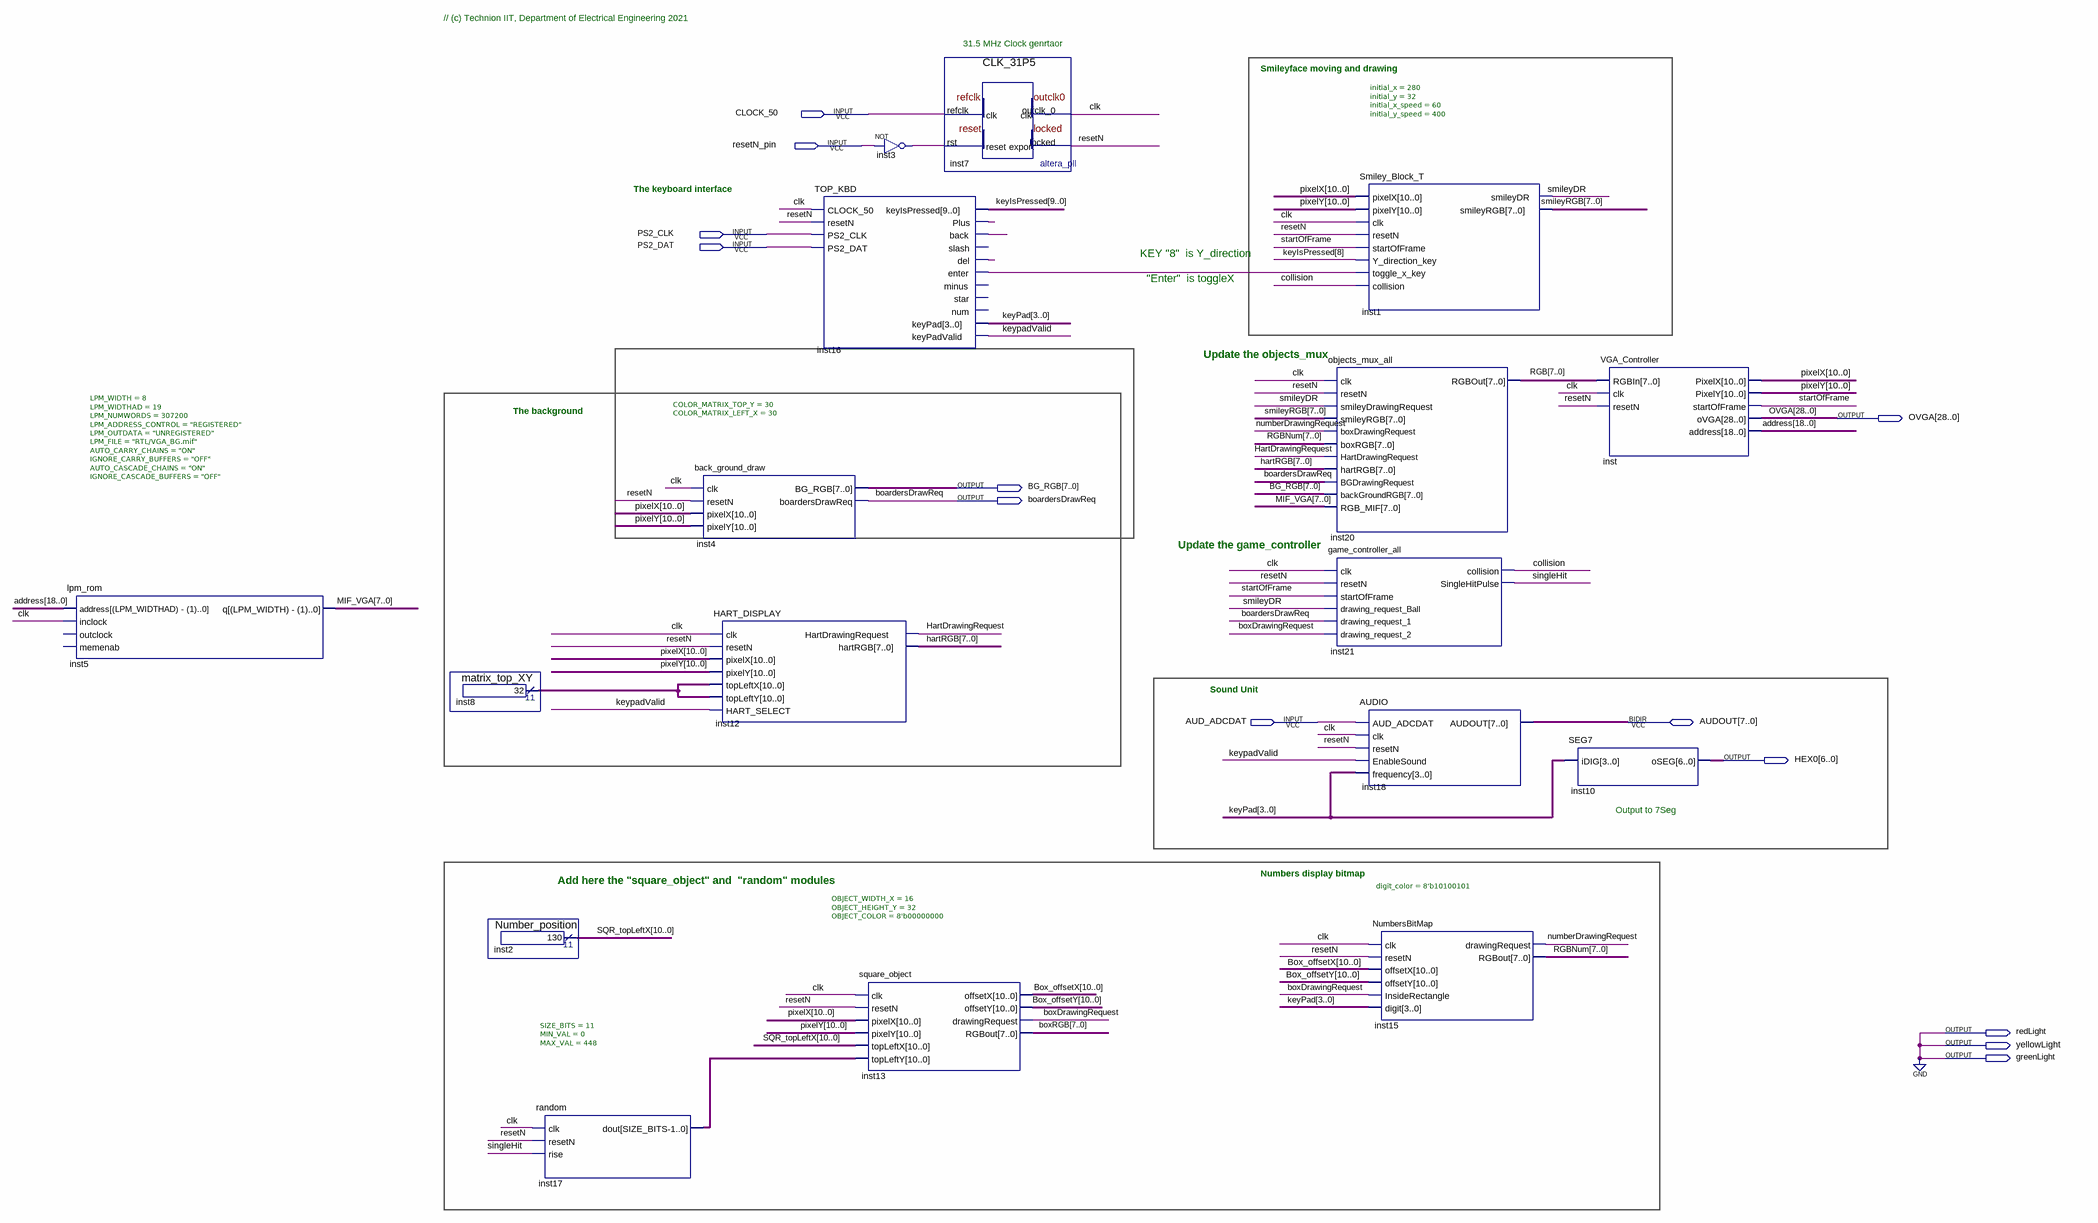
[diagram p0: schematic sheet]
// Quartus schematic TOP_VGA_DEMO_KBD.bdf as structural Verilog: 17 symbols, 13 pins
module TOP_VGA_DEMO_KBD (
  input  CLOCK_50,
  input  resetN_pin,
  input  PS2_CLK,
  input  PS2_DAT,
  input  AUD_ADCDAT,
  inout  [7:0] AUDOUT,
  output [28:0] OVGA,
  output [7:0] BG_RGB,
  output boardersDrawReq,
  output [6:0] HEX0,
  output redLight,
  output yellowLight,
  output greenLight
);

  wire boxDrawingRequest, clk, collision, HartDrawingRequest, inst3_out, inst16_back, inst16_del,
       inst16_enter, inst16_plus, keypadValid, numberDrawingRequest, resetN, singleHit, smileyDR,
       startOfFrame;
  wire [3:0] keyPad;
  wire [7:0] boxRGB, hartRGB, MIF_VGA, RGB, RGBNum, smileyRGB;
  wire [9:0] keyIsPressed;
  wire [10:0] Box_offsetX, Box_offsetY, inst8_result, inst17_dout, pixelX, pixelY, SQR_topLeftX;
  wire [18:0] address;

  lpm_rom #(.LPM_WIDTH(8), .LPM_WIDTHAD(19), .LPM_NUMWORDS(307200), .LPM_ADDRESS_CONTROL("REGISTERED"), .LPM_OUTDATA("UNREGISTERED"), .LPM_FILE("RTL/VGA_BG.mif"), .AUTO_CARRY_CHAINS("ON"), .IGNORE_CARRY_BUFFERS("OFF"), .AUTO_CASCADE_CHAINS("ON"), .IGNORE_CASCADE_BUFFERS("OFF")) inst5 (
    .address(address), .inclock(clk), .q(MIF_VGA));  // open: outclock, memenab
  matrix_top_XY inst8 (.result(inst8_result));
  Number_position inst2 (.result(SQR_topLeftX));
  random #(.SIZE_BITS(11), .MIN_VAL(0), .MAX_VAL(448)) inst17 (
    .clk(clk), .resetN(resetN), .rise(singleHit), .dout(inst17_dout));
  back_ground_draw #(.COLOR_MATRIX_TOP_Y(30), .COLOR_MATRIX_LEFT_X(30)) inst4 (
    .clk(clk), .resetN(resetN), .pixelX(pixelX), .pixelY(pixelY), .BG_RGB(BG_RGB),
    .boardersDrawReq(boardersDrawReq));
  HART_DISPLAY inst12 (
    .clk(clk), .resetN(resetN), .pixelX(pixelX), .pixelY(pixelY), .topLeftX(inst8_result),
    .topLeftY(inst8_result), .HART_SELECT(keypadValid), .HartDrawingRequest(HartDrawingRequest),
    .hartRGB(hartRGB));
  TOP_KBD inst16 (
    .CLOCK_50(clk), .resetN(resetN), .PS2_CLK(PS2_CLK), .PS2_DAT(PS2_DAT), .keyIsPressed(keyIsPressed),
    .Plus(inst16_plus), .back(inst16_back), .del(inst16_del), .enter(inst16_enter), .keyPad(keyPad),
    .keyPadValid(keypadValid));  // open: slash, minus, star, num
  not inst3 (inst3_out, resetN_pin);
  square_object #(.OBJECT_WIDTH_X(16), .OBJECT_HEIGHT_Y(32), .OBJECT_COLOR(8'b00000000)) inst13 (
    .clk(clk), .resetN(resetN), .pixelX(pixelX), .pixelY(pixelY), .topLeftX(SQR_topLeftX),
    .topLeftY(inst17_dout), .offsetX(Box_offsetX), .offsetY(Box_offsetY), .drawingRequest(boxDrawingRequest),
    .RGBout(boxRGB));
  CLK_31P5 inst7 (.refclk(CLOCK_50), .rst(inst3_out), .outclk_0(clk), .locked(resetN));
  objects_mux_all inst20 (
    .clk(clk), .resetN(resetN), .smileyDrawingRequest(smileyDR), .smileyRGB(smileyRGB),
    .boxDrawingRequest(numberDrawingRequest), .boxRGB(RGBNum), .HartDrawingRequest(HartDrawingRequest),
    .hartRGB(hartRGB), .BGDrawingRequest(boardersDrawReq), .backGroundRGB(BG_RGB), .RGB_MIF(MIF_VGA),
    .RGBOut(RGB));
  game_controller_all inst21 (
    .clk(clk), .resetN(resetN), .startOfFrame(startOfFrame), .drawing_request_Ball(smileyDR),
    .drawing_request_1(boardersDrawReq), .drawing_request_2(boxDrawingRequest), .collision(collision),
    .SingleHitPulse(singleHit));
  Smiley_Block_T #(.initial_x(280), .initial_y(32), .initial_x_speed(60), .initial_y_speed(400)) inst1 (
    .pixelX(pixelX), .pixelY(pixelY), .clk(clk), .resetN(resetN), .startOfFrame(startOfFrame),
    .Y_direction_key(keyIsPressed[8]), .toggle_x_key(inst16_enter), .collision(collision),
    .smileyDR(smileyDR), .smileyRGB(smileyRGB));
  AUDIO inst18 (
    .AUD_ADCDAT(AUD_ADCDAT), .clk(clk), .resetN(resetN), .EnableSound(keypadValid), .frequency(keyPad),
    .AUDOUT(AUDOUT));
  NumbersBitMap #(.digit_color(8'b10100101)) inst15 (
    .clk(clk), .resetN(resetN), .offsetX(Box_offsetX), .offsetY(Box_offsetY),
    .InsideRectangle(boxDrawingRequest), .digit(keyPad), .drawingRequest(numberDrawingRequest),
    .RGBout(RGBNum));
  VGA_Controller inst (
    .RGBIn(RGB), .clk(clk), .resetN(resetN), .PixelX(pixelX), .PixelY(pixelY), .startOfFrame(startOfFrame),
    .oVGA(OVGA), .address(address));
  SEG7 inst10 (.iDIG(keyPad), .oSEG(HEX0));

  assign greenLight = 1'b0;
  assign redLight = 1'b0;
  assign yellowLight = 1'b0;

  // Notes on the sheet:
  //   // (c) Technion IIT, Department of Electrical Engineering 2021
  //   31.5 MHz Clock genrtaor
  //   Smileyface moving and drawing
  //   The keyboard interface
  //   KEY "8"  is Y_direction
  //   "Enter"  is toggleX
  //   Update the objects_mux
  //   The background
  //   Update the game_controller
  //   Sound Unit
  //   Output to 7Seg
  //   Numbers display bitmap
  //   Add here the "square_object" and  "random" modules
endmodule
